# Altium project SolarPanelXPlus.PrjPcb
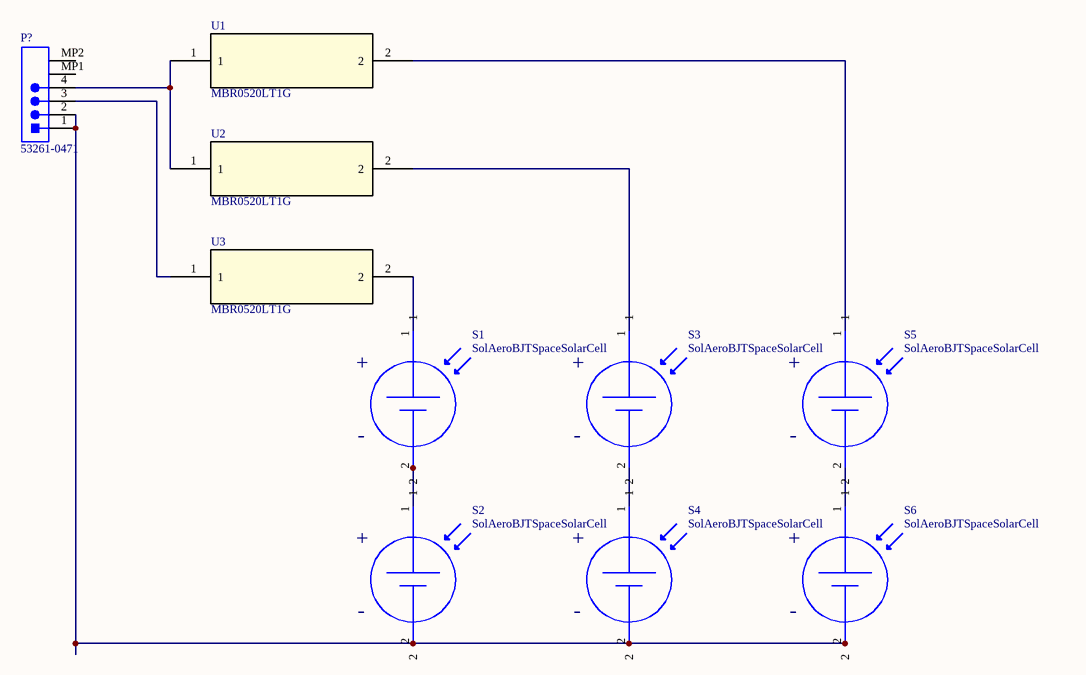
[diagram p0: SolarPanelXPlus.SchDoc]
1 sheet, 10 parts. Net scope: global (net labels, ports and power ports of the same name join across sheets).
Board file: SolarPanelXPlus.PcbDoc

## Sheet SolarPanelXPlus.SchDoc
size A

### Parts
P?  53261-0471  [MOLEX-53261-0471_V]
S1  SolAeroBJTSpaceSolarCell
S2  SolAeroBJTSpaceSolarCell
S3  SolAeroBJTSpaceSolarCell
S4  SolAeroBJTSpaceSolarCell
S5  SolAeroBJTSpaceSolarCell
S6  SolAeroBJTSpaceSolarCell
U1  MBR0520LT1G  [SOD-123]
U2  MBR0520LT1G  [SOD-123]
U3  MBR0520LT1G  [SOD-123]

### Nets
NetP?_1: P?.1 P?.2 S2.2 S4.2 S6.2
NetP?_3: P?.3 U3.1
NetP?_4: P?.4 U1.1 U2.1
NetS1_1: S1.1 U3.2
NetS1_2: S1.2 S2.1
NetS3_1: S3.1 U2.2
NetS3_2: S3.2 S4.1
NetS5_1: S5.1 U1.2
NetS5_2: S5.2 S6.1

Not connected (* = marked no-connect by the designer): P? MP1 MP2

### Notes on the sheet
- (in symbol SolAeroBJTSpaceSolarCell) +; -

### Library data of the parts
P? = CMP-2000-05238-1: Male Header, Pitch 1.25 mm, 1 x 4 Position, Height 3.4 mm, -40 to 85 degC, RoHS, Tape and Reel; Current Rating: 1A; Brand: Molex; Number of Positions / Contacts: 4; Pitch: 1.25mm; Voltage Rating: 125V; Mounting Angle: Right; Manufacturer URL: http://www.molex.com/; Factory Pack Quantity: 1000; Housing Material: Thermoplastic; Datasheet URL: http://www.molex.com/pdm_docs/sd/532610471_sd.pdf; Tradename: PicoBlade; Product Type: Headers; Contact Plating: Tin; Contact Material: PhosphorBronze; Package Description: 1.25mm Pitch PicoBlade(TM) Header, Surface Mount, Right Angle, Lead-Free, 4 Circuits; Mounting Style: SMD/SMT; Manufacturer: Molex; Series: 53261; Packaging: Reel; Number of Rows: 1; RoHS: Details; Number of Positions: 4; Product Category: Headers&WireHousings; Datasheet Version: Rev. G, 01/2012; Type: Shrouded; Termination Style: SMD
U1-U3 = MBR0520LT1G: Imported; Vendor: ON Semiconductor; C: Copyright (C) 2015 Accelerated Designs. All rights reserved; Manufacturer_Part_Number: MBR0520LT1G; Copyright: Copyright (C) 2015 Accelerated Designs. All rights reserved; Value: Value; Type: Type; RefDes: RefDes